# EAGLE design working (EAGLE 9.5.0)
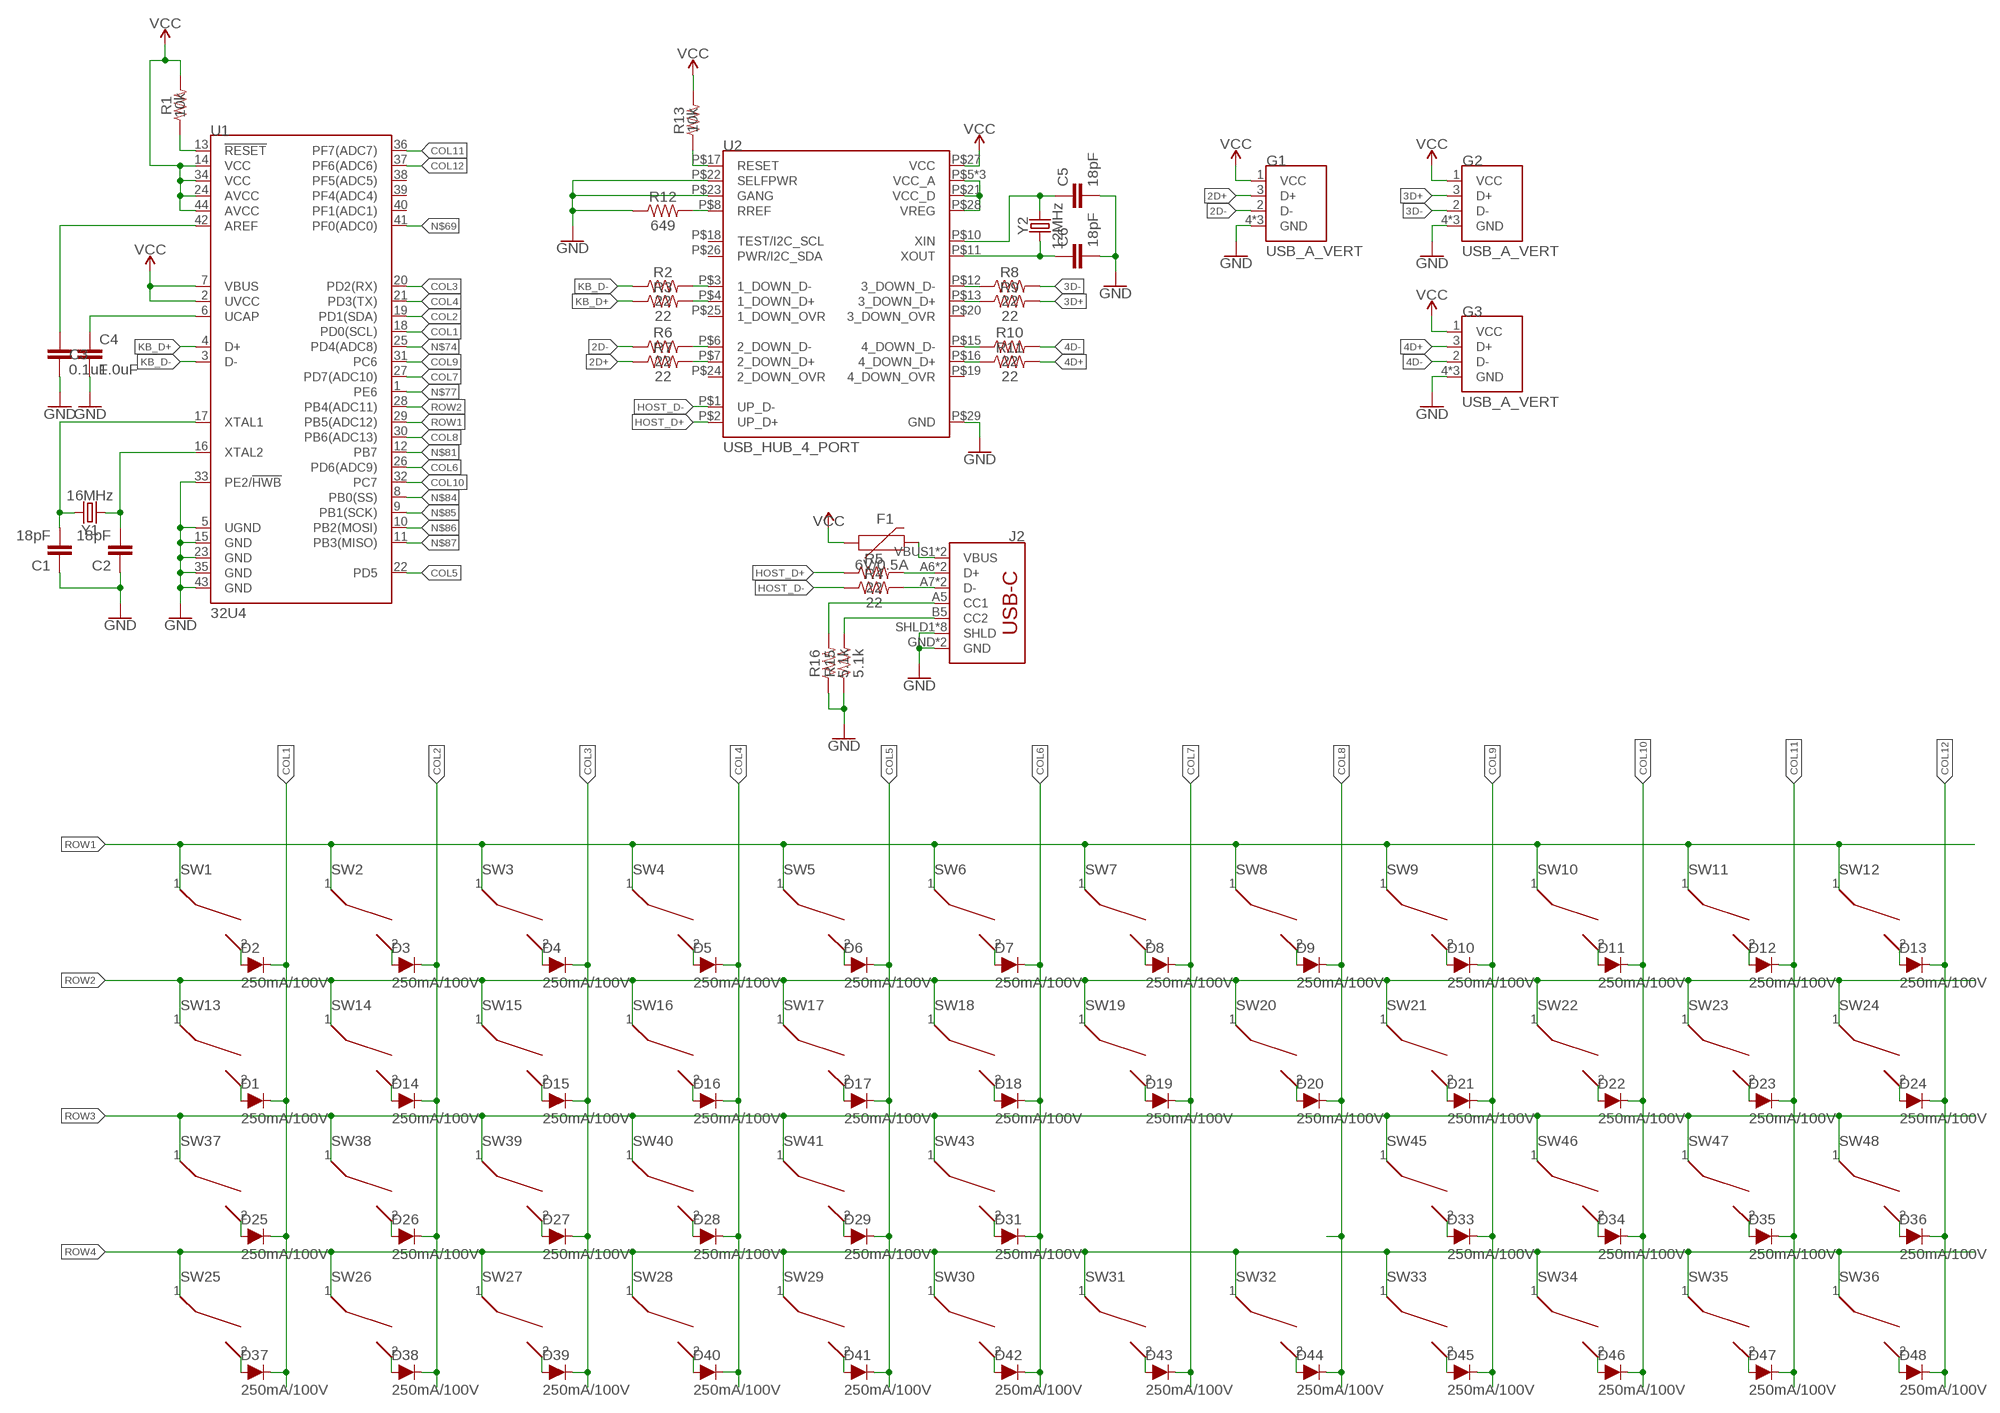
[diagram p0: schematic, sheet 1]

## Parts
C1  18pF  18PF-0603-50V-5%  [0603]
C2  18pF  18PF-0603-50V-5%  [0603]
C3  0.1uF  0.1UF-0603-25V-(+80/-20%)  [0603]
C4  1.0uF  1.0UF-0603-16V-10%  [0603]
C5  18pF  18PF-0603-50V-5%  [0603]
C6  18pF  18PF-0603-50V-5%  [0603]
D1  250mA/100V  DIODE-BAS16J  [SOD-323]
D2  250mA/100V  DIODE-BAS16J  [SOD-323]
D3  250mA/100V  DIODE-BAS16J  [SOD-323]
D4  250mA/100V  DIODE-BAS16J  [SOD-323]
D5  250mA/100V  DIODE-BAS16J  [SOD-323]
D6  250mA/100V  DIODE-BAS16J  [SOD-323]
D7  250mA/100V  DIODE-BAS16J  [SOD-323]
D8  250mA/100V  DIODE-BAS16J  [SOD-323]
D9  250mA/100V  DIODE-BAS16J  [SOD-323]
D10  250mA/100V  DIODE-BAS16J  [SOD-323]
D11  250mA/100V  DIODE-BAS16J  [SOD-323]
D12  250mA/100V  DIODE-BAS16J  [SOD-323]
D13  250mA/100V  DIODE-BAS16J  [SOD-323]
D14  250mA/100V  DIODE-BAS16J  [SOD-323]
D15  250mA/100V  DIODE-BAS16J  [SOD-323]
D16  250mA/100V  DIODE-BAS16J  [SOD-323]
D17  250mA/100V  DIODE-BAS16J  [SOD-323]
D18  250mA/100V  DIODE-BAS16J  [SOD-323]
D19  250mA/100V  DIODE-BAS16J  [SOD-323]
D20  250mA/100V  DIODE-BAS16J  [SOD-323]
D21  250mA/100V  DIODE-BAS16J  [SOD-323]
D22  250mA/100V  DIODE-BAS16J  [SOD-323]
D23  250mA/100V  DIODE-BAS16J  [SOD-323]
D24  250mA/100V  DIODE-BAS16J  [SOD-323]
D25  250mA/100V  DIODE-BAS16J  [SOD-323]
D26  250mA/100V  DIODE-BAS16J  [SOD-323]
D27  250mA/100V  DIODE-BAS16J  [SOD-323]
D28  250mA/100V  DIODE-BAS16J  [SOD-323]
D29  250mA/100V  DIODE-BAS16J  [SOD-323]
D31  250mA/100V  DIODE-BAS16J  [SOD-323]
D33  250mA/100V  DIODE-BAS16J  [SOD-323]
D34  250mA/100V  DIODE-BAS16J  [SOD-323]
D35  250mA/100V  DIODE-BAS16J  [SOD-323]
D36  250mA/100V  DIODE-BAS16J  [SOD-323]
D37  250mA/100V  DIODE-BAS16J  [SOD-323]
D38  250mA/100V  DIODE-BAS16J  [SOD-323]
D39  250mA/100V  DIODE-BAS16J  [SOD-323]
D40  250mA/100V  DIODE-BAS16J  [SOD-323]
D41  250mA/100V  DIODE-BAS16J  [SOD-323]
D42  250mA/100V  DIODE-BAS16J  [SOD-323]
D43  250mA/100V  DIODE-BAS16J  [SOD-323]
D44  250mA/100V  DIODE-BAS16J  [SOD-323]
D45  250mA/100V  DIODE-BAS16J  [SOD-323]
D46  250mA/100V  DIODE-BAS16J  [SOD-323]
D47  250mA/100V  DIODE-BAS16J  [SOD-323]
D48  250mA/100V  DIODE-BAS16J  [SOD-323]
F1  6V/0.5A  PPTC_6V500MA-2  [1206]
G1  USB_A_VERT  [USB_A_VERT]
G2  USB_A_VERT  [USB_A_VERT]
G3  USB_A_VERT  [USB_A_VERT]
J2  USB_C2-LAYER  [USB-C-16P]
R1  10k  10KOHM-0603-1/10W-1%  [0603]
R2  22  22OHM-0603-1/10W-1%  [0603]
R3  22  22OHM-0603-1/10W-1%  [0603]
R4  22  22OHM-0603-1/10W-1%  [0603]
R5  22  22OHM-0603-1/10W-1%  [0603]
R6  22  22OHM-0603-1/10W-1%  [0603]
R7  22  22OHM-0603-1/10W-1%  [0603]
R8  22  22OHM-0603-1/10W-1%  [0603]
R9  22  22OHM-0603-1/10W-1%  [0603]
R10  22  22OHM-0603-1/10W-1%  [0603]
R11  22  22OHM-0603-1/10W-1%  [0603]
R12  649  680OHM-0603-1/10W-5%  [0603]
R13  10k  10KOHM-0603-1/10W-1%  [0603]
R15  5.1k  5.1KOHM5.1KOHM-0603-1/10W-1%  [0603]
R16  5.1k  5.1KOHM5.1KOHM-0603-1/10W-1%  [0603]
SW1  CHERRY_MX_WITH_FIXING_PINS  [MX1A-XXNW]
SW2  CHERRY_MX_WITH_FIXING_PINS  [MX1A-XXNW]
SW3  CHERRY_MX_WITH_FIXING_PINS  [MX1A-XXNW]
SW4  CHERRY_MX_WITH_FIXING_PINS  [MX1A-XXNW]
SW5  CHERRY_MX_WITH_FIXING_PINS  [MX1A-XXNW]
SW6  CHERRY_MX_WITH_FIXING_PINS  [MX1A-XXNW]
SW7  CHERRY_MX_WITH_FIXING_PINS  [MX1A-XXNW]
SW8  CHERRY_MX_WITH_FIXING_PINS  [MX1A-XXNW]
SW9  CHERRY_MX_WITH_FIXING_PINS  [MX1A-XXNW]
SW10  CHERRY_MX_WITH_FIXING_PINS  [MX1A-XXNW]
SW11  CHERRY_MX_WITH_FIXING_PINS  [MX1A-XXNW]
SW12  CHERRY_MX_WITH_FIXING_PINS  [MX1A-XXNW]
SW13  CHERRY_MX_WITH_FIXING_PINS  [MX1A-XXNW]
SW14  CHERRY_MX_WITH_FIXING_PINS  [MX1A-XXNW]
SW15  CHERRY_MX_WITH_FIXING_PINS  [MX1A-XXNW]
SW16  CHERRY_MX_WITH_FIXING_PINS  [MX1A-XXNW]
SW17  CHERRY_MX_WITH_FIXING_PINS  [MX1A-XXNW]
SW18  CHERRY_MX_WITH_FIXING_PINS  [MX1A-XXNW]
SW19  CHERRY_MX_WITH_FIXING_PINS  [MX1A-XXNW]
SW20  CHERRY_MX_WITH_FIXING_PINS  [MX1A-XXNW]
SW21  CHERRY_MX_WITH_FIXING_PINS  [MX1A-XXNW]
SW22  CHERRY_MX_WITH_FIXING_PINS  [MX1A-XXNW]
SW23  CHERRY_MX_WITH_FIXING_PINS  [MX1A-XXNW]
SW24  CHERRY_MX_WITH_FIXING_PINS  [MX1A-XXNW]
SW25  CHERRY_MX_WITH_FIXING_PINS  [MX1A-XXNW]
SW26  CHERRY_MX_WITH_FIXING_PINS  [MX1A-XXNW]
SW27  CHERRY_MX_WITH_FIXING_PINS  [MX1A-XXNW]
SW28  CHERRY_MX_WITH_FIXING_PINS  [MX1A-XXNW]
SW29  CHERRY_MX_WITH_FIXING_PINS  [MX1A-XXNW]
SW30  CHERRY_MX_WITH_FIXING_PINS  [MX1A-XXNW]
SW31  CHERRY_MX_WITH_FIXING_PINS  [MX1A-XXNW]
SW32  CHERRY_MX_WITH_FIXING_PINS  [MX1A-XXNW]
SW33  CHERRY_MX_WITH_FIXING_PINS  [MX1A-XXNW]
SW34  CHERRY_MX_WITH_FIXING_PINS  [MX1A-XXNW]
SW35  CHERRY_MX_WITH_FIXING_PINS  [MX1A-XXNW]
SW36  CHERRY_MX_WITH_FIXING_PINS  [MX1A-XXNW]
SW37  CHERRY_MX_WITH_FIXING_PINS  [MX1A-XXNW]
SW38  CHERRY_MX_WITH_FIXING_PINS  [MX1A-XXNW]
SW39  CHERRY_MX_WITH_FIXING_PINS  [MX1A-XXNW]
SW40  CHERRY_MX_WITH_FIXING_PINS  [MX1A-XXNW]
SW41  CHERRY_MX_WITH_FIXING_PINS  [MX1A-XXNW]
SW43  CHERRY_MX_WITH_FIXING_PINS  [MX1A-XXNW]
SW45  CHERRY_MX_WITH_FIXING_PINS  [MX1A-XXNW]
SW46  CHERRY_MX_WITH_FIXING_PINS  [MX1A-XXNW]
SW47  CHERRY_MX_WITH_FIXING_PINS  [MX1A-XXNW]
SW48  CHERRY_MX_WITH_FIXING_PINS  [MX1A-XXNW]
U1  32U4  ATMEGA32U41:1  [QFN-44-NOPAD_1:1]
U2  USB_HUB_4_PORT  [QFN-28-5MM-1:1]
Y1  16MHz  CRYSTAL-16MHZSMD-5X3.2  [CRYSTAL-SMD-5X3.2-4PAD]
Y2  12MHz  CRYSTAL-12MHZ"  [CRYSTAL-SMD-5X3.2-4PAD]

## Nets
2D+: G1.3(D+) R7.1
2D-: G1.2(D-) R6.1
3D+: G2.3(D+) R9.2
3D-: G2.2(D-) R8.2
4D+: G3.3(D+) R11.2
4D-: G3.2(D-) R10.2
COL1: D1.C D2.C D25.C D37.C U1.18(PD0(SCL))
COL2: D3.C D14.C D26.C D38.C U1.19(PD1(SDA))
COL3: D4.C D15.C D27.C D39.C U1.20(PD2(RX))
COL4: D5.C D16.C D28.C D40.C U1.21(PD3(TX))
COL5: D6.C D17.C D29.C D41.C U1.22(PD5)
COL6: D7.C D18.C D31.C D42.C U1.26(PD6(ADC9))
COL7: D8.C D19.C D43.C U1.27(PD7(ADC10))
COL8: D9.C D20.C D44.C U1.30(PB6(ADC13))
COL9: D10.C D21.C D33.C D45.C U1.31(PC6)
COL10: D11.C D22.C D34.C D46.C U1.32(PC7)
COL11: D12.C D23.C D35.C D47.C U1.36(PF7(ADC7))
COL12: D13.C D24.C D36.C D48.C U1.37(PF6(ADC6))
GND: C1.1 C2.1 C3.2 C4.2 C5.2 C6.2 G1.4(GND) G1.SHIELD_1(GND) G1.SHIELD_2(GND) G2.4(GND) G2.SHIELD_1(GND) G2.SHIELD_2(GND) G3.4(GND) G3.SHIELD_1(GND) G3.SHIELD_2(GND) J2.GND J2.GND2(GND) J2.SHLD1(SHLD) J2.SHLD2(SHLD) J2.SHLD3(SHLD) J2.SHLD4(SHLD) J2.SHLD5(SHLD) J2.SHLD6(SHLD) J2.SHLD7(SHLD) J2.SHLD8(SHLD) R12.1 R15.1 R16.1 U1.5(UGND) U1.15(GND) U1.23(GND) U1.33(PE2/!HWB) U1.35(GND) U1.43(GND) U2.P$22(SELFPWR) U2.P$23(GANG) U2.P$29(GND)
HOST-: J2.A7(D-) J2.B7(D-) R4.2
HOST_D+: R5.1 U2.P$2(UP_D+)
HOST_D-: R4.1 U2.P$1(UP_D-)
KB_D+: R3.1 U1.4(D+)
KB_D-: R2.1 U1.3(D-)
KBD+: R3.2 U2.P$4(1_DOWN_D+)
KBD-: R2.2 U2.P$3(1_DOWN_D-)
N$1: D2.A SW1.2
N$2: D3.A SW2.2
N$3: D4.A SW3.2
N$4: D5.A SW4.2
N$5: D6.A SW5.2
N$6: D7.A SW6.2
N$7: D8.A SW7.2
N$8: D9.A SW8.2
N$9: D10.A SW9.2
N$10: D11.A SW10.2
N$11: D12.A SW11.2
N$12: D13.A SW12.2
N$13: D1.A SW13.2
N$14: D25.A SW37.2
N$15: D37.A SW25.2
N$16: D38.A SW26.2
N$17: D26.A SW38.2
N$18: D14.A SW14.2
N$19: D15.A SW15.2
N$20: D16.A SW16.2
N$21: D28.A SW40.2
N$22: D27.A SW39.2
N$23: D39.A SW27.2
N$24: D40.A SW28.2
N$25: D41.A SW29.2
N$26: D42.A SW30.2
N$27: D29.A SW41.2
N$28: D17.A SW17.2
N$29: D18.A SW18.2
N$30: J2.A6(D+) J2.B6(D+) R5.2
N$31: D43.A SW31.2
N$32: D31.A SW43.2
N$33: D19.A SW19.2
N$34: D23.A SW23.2
N$35: D22.A SW22.2
N$36: D21.A SW21.2
N$37: D20.A SW20.2
N$38: J2.A5(CC1) R16.2
N$39: D33.A SW45.2
N$40: D34.A SW46.2
N$41: D35.A SW47.2
N$42: D36.A SW48.2
N$43: D24.A SW24.2
N$44: D48.A SW36.2
N$45: D47.A SW35.2
N$46: D46.A SW34.2
N$47: D45.A SW33.2
N$48: D44.A SW32.2
N$49: R1.1 U1.13(!RESET)
N$50: C3.1 U1.42(AREF)
N$51: C1.2 U1.17(XTAL1) Y1.3
N$52: C2.2 U1.16(XTAL2) Y1.1
N$53: C4.1 U1.6(UCAP)
N$54: R6.2 U2.P$6(2_DOWN_D-)
N$55: U2.P$5(VCC_A) U2.P$9(VCC_A) U2.P$14(VCC_A) U2.P$21(VCC_D) U2.P$28(VREG)
N$56: R7.2 U2.P$7(2_DOWN_D+)
N$57: R8.1 U2.P$12(3_DOWN_D-)
N$58: R9.1 U2.P$13(3_DOWN_D+)
N$59: R10.1 U2.P$15(4_DOWN_D-)
N$60: R11.1 U2.P$16(4_DOWN_D+)
N$61: C5.1 U2.P$10(XIN) Y2.3
N$62: C6.1 U2.P$11(XOUT) Y2.1
N$64: R13.1 U2.P$17(RESET)
N$65: F1.2 J2.VBUS1(VBUS) J2.VBUS2(VBUS)
N$66: R12.2 U2.P$8(RREF)
N$67: J2.B5(CC2) R15.2
N$69: U1.41(PF0(ADC0))
N$74: U1.25(PD4(ADC8))
N$77: U1.1(PE6)
N$81: U1.12(PB7)
N$84: U1.8(PB0(SS))
N$85: U1.9(PB1(SCK))
N$86: U1.10(PB2(MOSI))
N$87: U1.11(PB3(MISO))
ROW1: SW1.1 SW2.1 SW3.1 SW4.1 SW5.1 SW6.1 SW7.1 SW8.1 SW9.1 SW10.1 SW11.1 SW12.1 U1.29(PB5(ADC12))
ROW2: SW13.1 SW14.1 SW15.1 SW16.1 SW17.1 SW18.1 SW19.1 SW20.1 SW21.1 SW22.1 SW23.1 SW24.1 U1.28(PB4(ADC11))
ROW3: SW37.1 SW38.1 SW39.1 SW40.1 SW41.1 SW43.1 SW45.1 SW46.1 SW47.1 SW48.1
ROW4: SW25.1 SW26.1 SW27.1 SW28.1 SW29.1 SW30.1 SW31.1 SW32.1 SW33.1 SW34.1 SW35.1 SW36.1
VCC: F1.1 G1.1(VCC) G2.1(VCC) G3.1(VCC) R1.2 R13.2 U1.2(UVCC) U1.7(VBUS) U1.14(VCC) U1.24(AVCC) U1.34(VCC) U1.44(AVCC) U2.P$27(VCC)
Unconnected: U1.38(PF5(ADC5)) U1.39(PF4(ADC4)) U1.40(PF1(ADC1)) U2.P$18(TEST/I2C_SCL) U2.P$19(4_DOWN_OVR) U2.P$20(3_DOWN_OVR) U2.P$24(2_DOWN_OVR) U2.P$25(1_DOWN_OVR) U2.P$26(PWR/I2C_SDA)

## Library data of the parts
C1 C2 C5 C6 = SparkFun-Capacitors:18PF: 18pF ceramic capacitors A capacitor is a passive two-terminal electrical component used to store electrical energy temporarily in an electric field.; PROD_ID: CAP-08267
C3 = SparkFun-Capacitors:0.1UF: 0.1µF ceramic capacitors A capacitor is a passive two-terminal electrical component used to store electrical energy temporarily in an electric field.; PROD_ID: CAP-00810
C4 = SparkFun-Capacitors:1.0UF: 1µF ceramic capacitors A capacitor is a passive two-terminal electrical component used to store electrical energy temporarily in an electric field.; PROD_ID: CAP-00868
D1-D29 D31 D33-D48 = SparkFun-DiscreteSemi:DIODE: Diode These are standard reverse protection diodes and small signal diodes. SparkFun Products: SparkFun SparkPunk Sound Kit <https://www.sparkfun.com/products/11177> SparkFun ESP8266 Thing <https://www.sparkfun.com/products/13231>; PROD_ID: DIO-09646
F1 = SparkFun-Fuses:PPTC: Resettable Fuse PPTC Resettable Fuse. Really a sort of resistor with a polymeric positive temperature coefficient whose resistance increases dramatically with an increase in temperature. When heated by the power passing through the resistance rises causing the current to be limited, protecting the circuit. This is achieved by the transition of the polymer from a crystalline to an amorphous state where the conductive carbon separates breaking the conductive pathways found in the cool crystalline structure. When a PPTC cools back down it resumes conducting letting the circuit turn back on. SparkFun Products: SparkFun RedBoard - Programmed with Arduino <https://www.sparkfun.com/products/12757> Pro Micro - 5V/16MHz <https://www.sparkfun.com/products/12640> Arduino Pro 328 - 5V/16MHz <https://www.sparkfun.com/products/10915> MP3 Trigger <https://www.sparkfun.com/products/13720>; PROD_ID: RES-08585
G1-G3 = asst:USB_A_VERT
J2 = SparkFun-Connectors:USB_C: USB Type C 16Pin Connector Super Speed pins not available on the 16-pin purely SMD connector so this part is best for USB 2.0 implementations. D1 and D2 are tied together enabling D+/- no matter which way the cable is plugged into the connector. The two channel configuration pins (CC1/2) are exposed. These are normally connected to ground via 5.1k resistors but can be reconfigured for high current/high power applications.; PROD_ID: CONN-14122
R1 R13 = SparkFun-Resistors:10KOHM: 10kΩ resistor A resistor is a passive two-terminal electrical component that implements electrical resistance as a circuit element. Resistors act to reduce current flow, and, at the same time, act to lower voltage levels within circuits. - Wikipedia; PROD_ID: RES-00824
R2-R11 = SparkFun-Resistors:22OHM: 22Ω resistor A resistor is a passive two-terminal electrical component that implements electrical resistance as a circuit element. Resistors act to reduce current flow, and, at the same time, act to lower voltage levels within circuits. - Wikipedia; PROD_ID: RES-08698
R12 = SparkFun-Resistors:680OHM: 680Ω resistor A resistor is a passive two-terminal electrical component that implements electrical resistance as a circuit element. Resistors act to reduce current flow, and, at the same time, act to lower voltage levels within circuits. - Wikipedia; PROD_ID: RES-09333; VALUE: 680
R15 R16 = SparkFun-Resistors:5.1KOHM; PROD_ID: RES-12083
SW1-SW41 SW43 SW45-SW48 = Cherry_MX_v7.0:CHERRY_MX
U1 = SparkFun-IC-Microcontroller:ATMEGA32U4: Atmel MCU, 32KByte Atmel 44-pin 8-bit Microcontroller with 32KBytes of ISP Flash and USB Controller Datasheet <http://cdn.sparkfun.com/datasheets/Dev/Arduino/Boards/ATMega32U4.pdf> SparkFun Products LilyPad Arduino USB - ATmega32U4 Board <https://www.sparkfun.com/products/12049> (DEV-12049) Pro Micro - 5V/16MHz <https://www.sparkfun.com/products/12640> (DEV-12640) Pro Micro - 3.3V/8MHz <https://www.sparkfun.com/products/12587> (DEV-12587) Fio v3 - ATmega32U4 <https://www.sparkfun.com/products/11520> (DEV-11520) Qduino Mini <https://www.sparkfun.com/products/13614> (DEV-13614) Makey Makey - Standard Kit <https://www.sparkfun.com/products/11511> (WIG-11511) Makey Makey Deluxe Kit <https://www.sparkfun.com/products/11519> (WIG-11519); PROD_ID: IC-10828
U2 = asst:USB_HUB_4_PORT
Y1 = SparkFun-Clocks:CRYSTAL-16MHZ: 16MHz Crystal Digikey Example <http://www.digikey.com/product-search/en?keywords=535-9122-1-ND> Frequency: 16MHz Frequency Stability: ±50ppm Frequency Tolerance: ±20ppm Load Capacitance: 18pF SparkFun Products: Pro Micro -5V/16MHz <https://www.sparkfun.com/products/12640> SparkFun Serial Enabled LCD Kit <https://www.sparkfun.com/products/10097>; PROD_ID: XTAL-08218; SF_ID: COM-00094
Y2 = SparkFun-Clocks:CRYSTAL-12MHZ: 12.0MHz Crystal Frequency: 12.0MHz Frequency Tolerance: ±20ppm Load Capacitance: 18pF SparkFun Products: SparkFun Logomatic <https://www.sparkfun.com/products/12772> Pocket AVR Programmer <https://www.sparkfun.com/products/9825>; PROD_ID: XTAL-08297

## Board
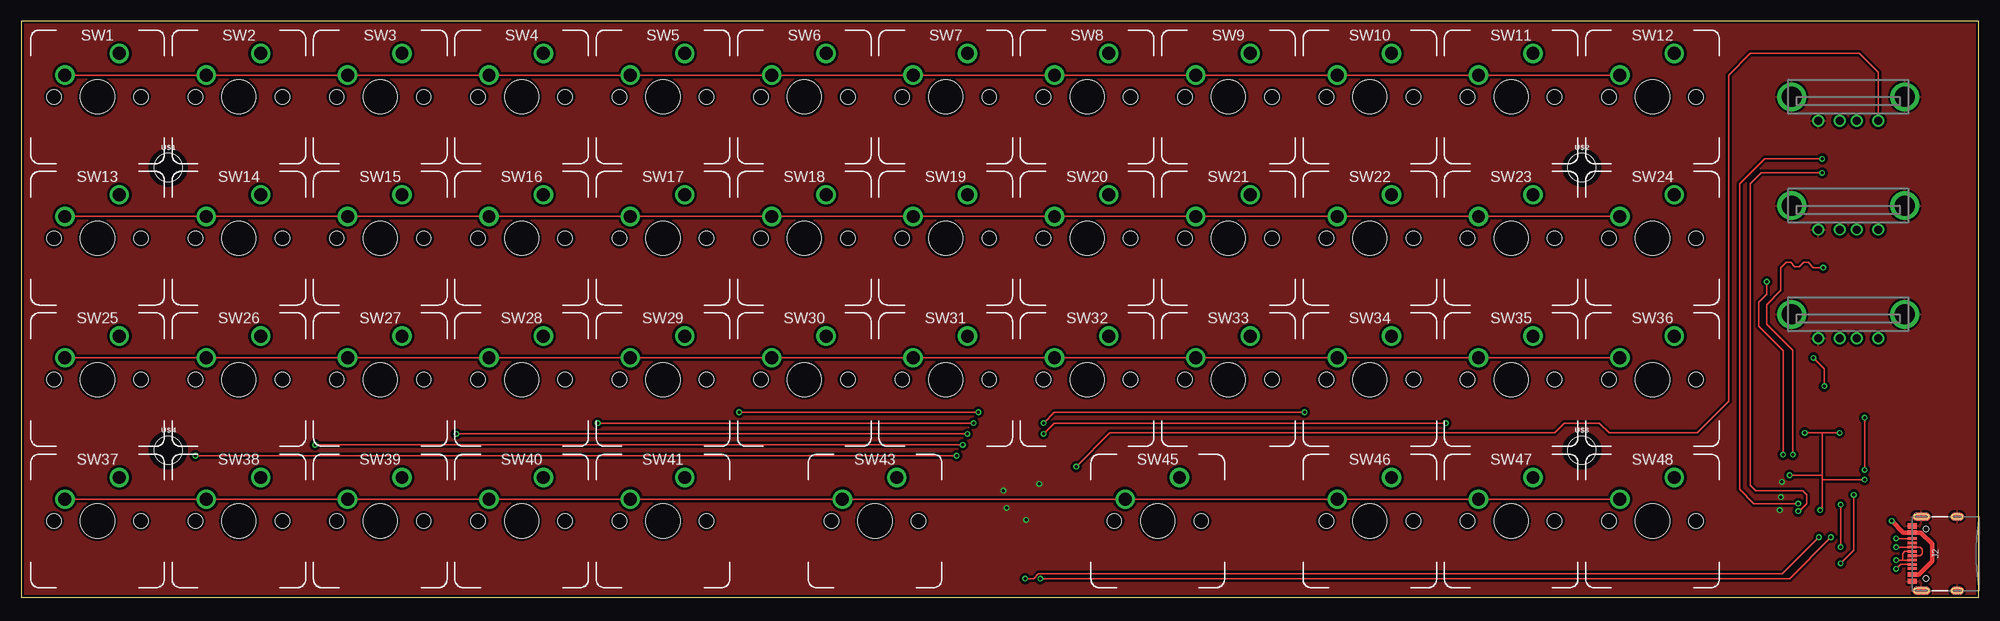
[diagram p1: board, top side]
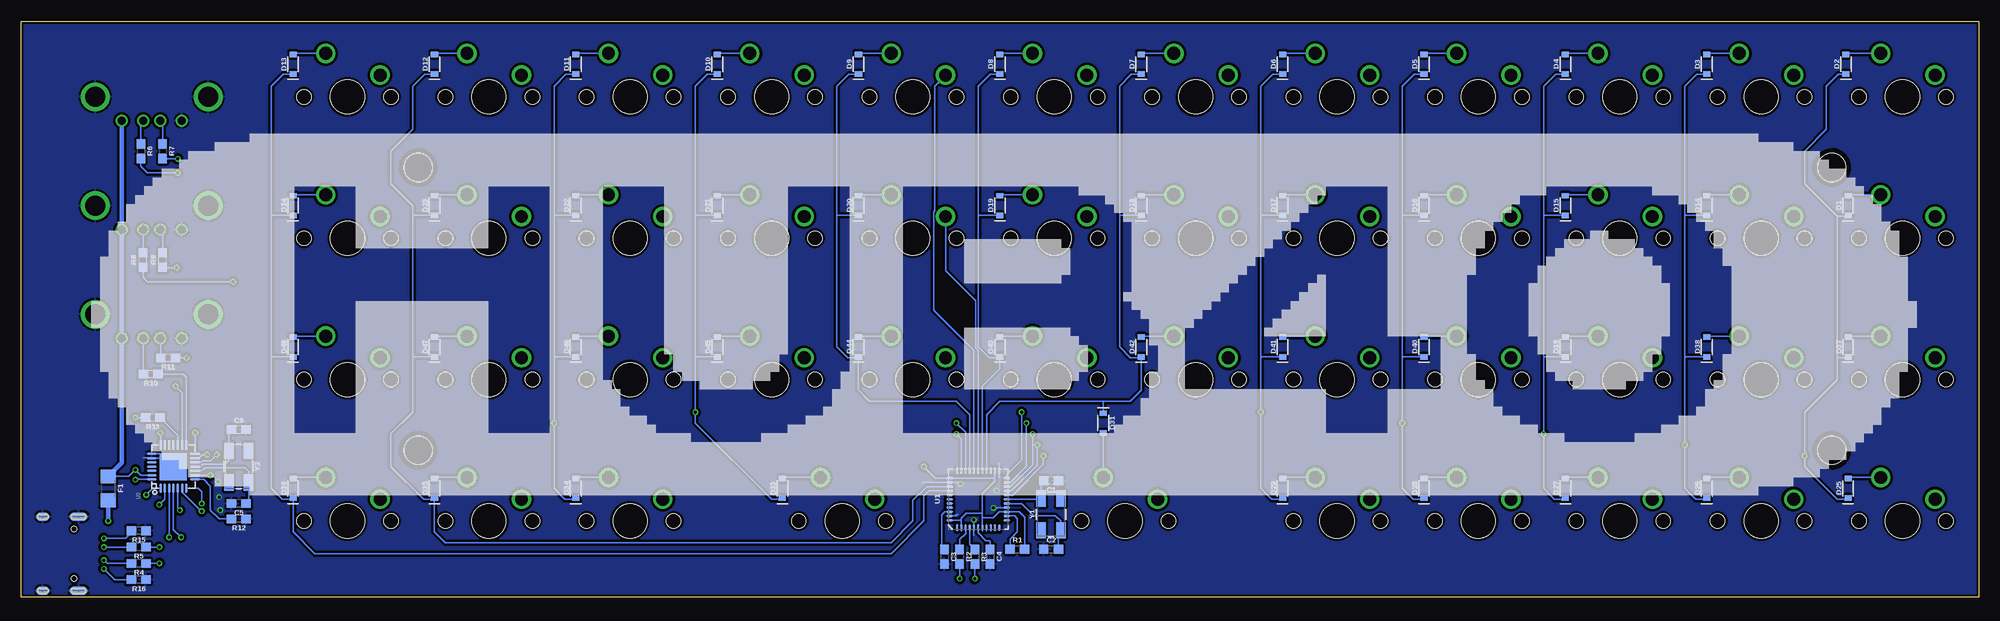
[diagram p2: board, bottom side, seen from below]

Size 228.58 x 67.23 mm. Coordinates in mm from the lower left corner, seen from the top.
Outline: 0,0 228.58,0 228.58,67.23 0,67.23 0,0
Copper layers (1*16): Top 0.035mm / dielectric 1.5mm / Bottom 0.035mm
Design rules "SparkFun-2-layer-PCBWay-LIMIT": minimum track width 6mil, minimum drill 0.3mm, track to track 6mil, track to pad 6mil, pad to pad 6mil, via to via 6mil, smd to smd 6mil, copper to edge 6mil, drill to drill 6mil, minimum pad ring 6mil, minimum via ring 6mil, stop-mask expansion 4mil, vias tented up to drill 25mil, thermal gap 10mil

### Footprints (pad centres in the part's own frame; a part is rotated, then mirrored left to right if it is on the bottom)
0603 = smd 1.1 x 1: 1 -0.85,0; 2 0.85,0
SOD-323 = smd 0.63 x 0.83: A 1.15,0; C -1.15,0
1206 = smd 1.6 x 1.8: 1 -1.4,0; 2 1.4,0
USB_A_VERT = drill 0.92: 1 -3.5,2.8; 2 -1,2.8; 3 1,2.8; 4 3.5,2.8 | drill 2.33: SHIELD_1 -6.6,0; SHIELD_2 6.6,0
USB-C-16P = smd 0.3 x 1.016: A5 -1.25,0.154; A6 -0.25,0.154; A7 0.25,0.154; A8 1.25,0.154; B5 1.75,0.154; B6 0.75,0.154; B7 -0.75,0.154; B8 -1.75,0.154 | smd 0.6 x 1.016: GND -3.225,0.154; GND2 3.225,0.154 | smd 1 x 2.1: SHLD1 -4.32,-0.915; SHLD2 4.32,-0.915 | smd 1 x 2.1 bottom: SHLD3 -4.32,-0.915; SHLD4 4.32,-0.915 | smd 1 x 1.6: SHLD5 -4.32,-5.095; SHLD8 4.32,-5.095 | smd 1 x 1.6 bottom: SHLD6 -4.32,-5.095; SHLD7 4.32,-5.095 | smd 0.55 x 1.016: VBUS1 -2.45,0.154; VBUS2 2.45,0.154 | hole 0.65: -2.89,-1.445; 2.89,-1.445
MX1A-XXNW = drill 1.5: 1 -3.81,2.54; 2 2.54,5.08 | hole 4: 0,0 | hole 1.7: -5.08,0; 5.08,0
QFN-44-NOPAD_1:1 = smd 0.8 x 0.3: 1 -3.337,2.458; 2 -3.337,1.958; 3 -3.337,1.479; 4 -3.337,0.979; 5 -3.337,0.5; 6 -3.337,0; 7 -3.337,-0.5; 8 -3.337,-0.979; 9 -3.337,-1.479; 10 -3.337,-1.958; 11 -3.337,-2.458; 23 3.337,-2.458; 24 3.337,-1.958; 25 3.337,-1.479; 26 3.337,-0.979; 27 3.337,-0.5; 28 3.337,0; 29 3.337,0.5; 30 3.337,0.979; 31 3.337,1.479; 32 3.337,1.958; 33 3.337,2.458 | smd 0.3 x 0.8: 12 -2.458,-3.337; 13 -1.958,-3.337; 14 -1.479,-3.337; 15 -0.979,-3.337; 16 -0.5,-3.337; 17 0,-3.337; 18 0.5,-3.337; 19 0.979,-3.337; 20 1.479,-3.337; 21 1.958,-3.337; 22 2.458,-3.337; 34 2.458,3.337; 35 1.958,3.337; 36 1.479,3.337; 37 0.979,3.337; 38 0.5,3.337; 39 0,3.337; 40 -0.5,3.337; 41 -0.979,3.337; 42 -1.479,3.337; 43 -1.958,3.337; 44 -2.458,3.337
QFN-28-5MM-1:1 = smd 1.15 x 0.3: P$1 -2.527,1.5; P$2 -2.527,1; P$3 -2.527,0.5; P$4 -2.527,0; P$5 -2.527,-0.5; P$6 -2.527,-1; P$7 -2.527,-1.5; P$15 2.527,-1.5; P$16 2.527,-1; P$17 2.527,-0.5; P$18 2.527,0; P$19 2.527,0.5; P$20 2.527,1; P$21 2.527,1.5 | smd 0.3 x 1.15: P$8 -1.5,-2.527; P$9 -1,-2.527; P$10 -0.5,-2.527; P$11 0,-2.527; P$12 0.5,-2.527; P$13 1,-2.527; P$14 1.5,-2.527; P$22 1.5,2.527; P$23 1,2.527; P$24 0.5,2.527; P$25 0,2.527; P$26 -0.5,2.527; P$27 -1,2.527; P$28 -1.5,2.527 | smd 3.15 x 3.15: P$29 0,0
STAND-OFF = hole 3.302: 0,0
CRYSTAL-SMD-5X3.2-4PAD = smd 1.9 x 1.1: 1 -1.85,-1.15; 2 1.85,-1.15; 3 1.85,1.15; 4 -1.85,1.15

### Placement (x,y rotation side)
C1  108.33,13.59 180 bottom
C2  108.33,5.59 0 bottom
C3  120.78,4.7 270 bottom
C4  115.44,4.7 270 bottom
C5  203.2,10.92 180 bottom
C6  203.2,19.56 0 bottom
D1  15.24,45.72 90 bottom
D2  15.49,62.23 90 bottom
D3  31.75,62.23 90 bottom
D4  48.26,62.23 90 bottom
D5  64.77,62.23 90 bottom
D6  81.28,62.23 90 bottom
D7  97.79,62.23 90 bottom
D8  114.3,62.23 90 bottom
D9  130.81,62.23 90 bottom
D10  147.32,62.23 90 bottom
D11  163.83,62.23 90 bottom
D12  180.34,62.23 90 bottom
D13  196.85,62.23 90 bottom
D14  31.75,45.72 90 bottom
D15  48.26,45.72 90 bottom
D16  64.77,45.72 90 bottom
D17  81.28,45.72 90 bottom
D18  97.79,45.72 90 bottom
D19  114.3,45.72 90 bottom
D20  130.81,45.72 90 bottom
D21  147.32,45.72 90 bottom
D22  163.83,45.72 90 bottom
D23  180.34,45.72 90 bottom
D24  196.85,45.72 90 bottom
D25  15.24,12.7 90 bottom
D26  31.75,12.7 90 bottom
D27  48.26,12.7 90 bottom
D28  64.77,12.7 90 bottom
D29  81.28,12.7 90 bottom
D31  102.23,20.32 270 bottom
D33  139.7,12.7 90 bottom
D34  163.83,12.7 90 bottom
D35  180.34,12.7 90 bottom
D36  196.85,12.7 90 bottom
D37  15.24,29.21 90 bottom
D38  31.75,29.21 90 bottom
D39  48.26,29.21 90 bottom
D40  64.77,29.21 90 bottom
D41  81.28,29.21 90 bottom
D42  97.79,29.21 90 bottom
D43  114.3,29.21 90 bottom
D44  130.81,29.21 90 bottom
D45  147.32,29.21 90 bottom
D46  163.83,29.21 90 bottom
D47  180.34,29.21 90 bottom
D48  196.85,29.21 90 bottom
F1  218.44,12.7 270 bottom
G1  213.36,58.42 180 top
G2  213.36,45.72 180 top
G3  213.36,33.02 180 top
J2  220.98,5.08 90 top
R1  112.27,5.59 0 bottom
R2  119,4.7 270 bottom
R3  117.22,4.7 270 bottom
R4  214.88,3.94 180 bottom
R5  214.88,5.84 180 bottom
R6  214.63,52.07 270 bottom
R7  212.09,52.07 270 bottom
R8  214.38,39.37 90 bottom
R9  212.09,39.37 90 bottom
R10  213.49,26.04 180 bottom
R11  211.46,27.94 180 bottom
R12  203.2,9.14 180 bottom
R13  213.23,20.95 180 bottom
R15  214.88,7.75 180 bottom
R16  214.88,2.03 180 bottom
SW1  8.89,58.42 0 top
SW2  25.4,58.42 0 top
SW3  41.91,58.42 0 top
SW4  58.42,58.42 0 top
SW5  74.93,58.42 0 top
SW6  91.44,58.42 0 top
SW7  107.95,58.42 0 top
SW8  124.46,58.42 0 top
SW9  140.97,58.42 0 top
SW10  157.48,58.42 0 top
SW11  173.99,58.42 0 top
SW12  190.5,58.42 0 top
SW13  8.89,41.91 0 top
SW14  25.4,41.91 0 top
SW15  41.91,41.91 0 top
SW16  58.42,41.91 0 top
SW17  74.93,41.91 0 top
SW18  91.44,41.91 0 top
SW19  107.95,41.91 0 top
SW20  124.46,41.91 0 top
SW21  140.97,41.91 0 top
SW22  157.48,41.91 0 top
SW23  173.99,41.91 0 top
SW24  190.5,41.91 0 top
SW25  8.89,25.4 0 top
SW26  25.4,25.4 0 top
SW27  41.91,25.4 0 top
SW28  58.42,25.4 0 top
SW29  74.93,25.4 0 top
SW30  91.44,25.4 0 top
SW31  107.95,25.4 0 top
SW32  124.46,25.4 0 top
SW33  140.97,25.4 0 top
SW34  157.48,25.4 0 top
SW35  173.99,25.4 0 top
SW36  190.5,25.4 0 top
SW37  8.89,8.89 0 top
SW38  25.4,8.89 0 top
SW39  41.91,8.89 0 top
SW40  58.42,8.89 0 top
SW41  74.93,8.89 0 top
SW43  99.69,8.89 0 top
SW45  132.72,8.89 0 top
SW46  157.48,8.89 0 top
SW47  173.99,8.89 0 top
SW48  190.5,8.89 0 top
U1  116.84,11.43 90 bottom
U2  210.82,15.24 90 bottom
U$1  [STAND-OFF]  17.14,50.16 0 top
U$2  [STAND-OFF]  182.25,50.16 0 top
U$3  [STAND-OFF]  182.25,17.14 0 top
U$4  [STAND-OFF]  17.14,17.14 0 top
U$5  [HUB400]  223.52,33.02 0 bottom
Y1  108.33,9.65 90 bottom
Y2  203.2,15.24 270 bottom

### Tracks (layer width: path | path; a pad name or v marks a point on that pad's centre or on a via)
2D+
  Bottom 0.152: R7.1 212.09,55.35 G1.3
2D-
  Bottom 0.152: R6.1 214.63,55.35 G1.2
3D+
  Bottom 0.152: R9.2 212.09,42.65 G2.3
3D-
  Bottom 0.152: R8.2 214.38,42.9 G2.2
4D+
  Bottom 0.152: R11.2 212.31,30.16 G3.3
4D-
  Bottom 0.152: R10.2 214.34,30.2 G3.2
COL1  (via drill 0.35)
  Top 0.152: v109.22,16.51 v20.32,16.51
  Bottom 0.152: D25.C 15.36,11.43 16.51,11.43 20.32,15.24 v20.32,16.51 20.32,21.59 16.51,25.4 16.51,27.94 | U1.18 113.48,11.9 112.83,11.9 109.22,15.51 v109.22,16.51 | D2.C 16.39,61.08 17.78,59.69 17.78,54.61 20.32,52.07 20.32,48.26 16.51,44.45 | 16.51,44.45 15.36,44.45 D1.C | D37.C 15.36,27.94 16.51,27.94 | 16.51,27.94 16.51,44.45
COL2  (via drill 0.35)
  Top 0.152: v109.93,17.78 v34.29,17.78
  Bottom 0.152: D3.C 32.9,61.08 34.29,59.69 34.29,44.45 | 34.29,44.45 34.29,27.94 | 34.29,27.94 v34.29,17.78 34.29,12.7 33.02,11.43 31.87,11.43 D26.C | D38.C 34.17,28.06 34.29,27.94 | D14.C 34.17,44.57 34.29,44.45 | U1.19 112.96,12.4 109.93,15.43 v109.93,17.78
COL3  (via drill 0.35)
  Top 0.152: v110.49,19.05 v50.8,19.05
  Bottom 0.152: D4.C 49.41,61.08 50.8,59.69 50.8,44.45 | 50.8,44.45 50.8,27.94 | 50.8,27.94 v50.8,19.05 50.8,12.7 49.53,11.43 48.38,11.43 D27.C | D39.C 50.68,28.06 50.8,27.94 | D15.C 50.68,44.57 50.8,44.45 | U1.20 113.48,12.88 113.08,12.88 110.49,15.48 v110.49,19.05
COL4  (via drill 0.35)
  Top 0.152: v111.2,20.32 v67.31,20.32
  Bottom 0.152: D5.C 65.92,61.08 67.31,59.69 67.31,44.45 | 67.31,44.45 67.31,27.94 | 67.31,27.94 v67.31,20.32 67.31,12.7 66.04,11.43 64.89,11.43 D28.C | D40.C 67.19,28.06 67.31,27.94 | D16.C 67.19,44.57 67.31,44.45 | U1.21 113.08,13.38 111.2,15.26 v111.2,20.32
COL5  (via drill 0.35)
  Top 0.152: v111.76,21.59 v83.82,21.59
  Bottom 0.152: D6.C 82.43,61.08 83.82,59.69 83.82,44.45 | 83.82,44.45 83.82,27.94 | 83.82,27.94 v83.82,21.59 83.82,12.7 82.55,11.43 81.4,11.43 D29.C | D41.C 83.7,28.06 83.82,27.94 | D17.C 83.7,44.57 83.82,44.45 | U1.22 113.5,14.27 111.76,16.01 v111.76,21.59
COL6
  Bottom 0.152: D7.C 98.94,61.08 100.33,59.69 100.33,44.45 | 100.33,44.45 100.33,29.21 99.06,27.94 97.91,27.94 97.85,28 | 97.85,28 D42.C | D18.C 100.21,44.57 100.33,44.45 | U1.26 115.86,21.3 114.3,22.86 102.23,22.86 | 102.23,22.86 99.06,22.86 97.79,24.13 97.79,27.94 97.85,28 | D31.C 102.23,22.86
COL7
  Bottom 0.152: D8.C 115.45,61.08 116.84,59.69 116.84,44.45 | 116.84,44.45 116.84,29.21 115.57,27.94 114.42,27.94 | 114.42,27.94 D43.C | D19.C 116.72,44.57 116.84,44.45 | U1.27 116.34,24.63 114.3,26.67 114.3,27.82 114.42,27.94
COL8
  Bottom 0.152: D9.C 131.96,61.08 133.35,59.69 133.35,44.45 | 133.35,44.45 133.35,29.21 132.08,27.94 130.93,27.94 130.87,28 | 130.87,28 D44.C | D20.C 133.23,44.57 133.35,44.45 | U1.30 117.82,21.3 119.38,22.86 129.54,22.86 130.87,24.19 130.87,28
COL9  (via drill 0.35)
  Top 0.152: v119.38,20.32 120.65,21.59 v149.86,21.59
  Bottom 0.152: D10.C 148.47,61.08 149.86,59.69 149.86,44.45 | 149.86,44.45 149.86,27.94 | 149.86,27.94 v149.86,21.59 149.86,20.32 140.97,11.43 139.82,11.43 D33.C | D45.C 149.74,28.06 149.86,27.94 | D21.C 149.74,44.57 149.86,44.45 | U1.31 118.32,19.26 v119.38,20.32
COL10  (via drill 0.35)
  Top 0.152: v119.38,19.05 120.65,20.32 v166.37,20.32
  Bottom 0.152: D11.C 164.98,61.08 166.37,59.69 166.37,44.45 | 166.37,44.45 166.37,27.94 | 166.37,27.94 v166.37,20.32 166.37,12.7 165.1,11.43 163.95,11.43 D34.C | D46.C 166.25,28.06 166.37,27.94 | D22.C 166.25,44.57 166.37,44.45 | U1.32 118.8,18.47 v119.38,19.05
COL11
  Bottom 0.152: D12.C 181.49,61.08 182.88,59.69 182.88,54.61 185.42,52.07 185.42,48.26 182.88,45.72 182.88,44.45 | 182.88,44.45 182.88,27.94 | 182.88,27.94 182.88,21.59 185.42,19.05 185.42,15.24 181.61,11.43 180.46,11.43 D35.C 180.34,7.62 179.07,6.35 127,6.35 124.46,8.89 124.46,11.3 122.85,12.91 U1.36 | D47.C 182.76,28.06 182.88,27.94 | D23.C 182.76,44.57 182.88,44.45
COL12
  Bottom 0.152: D13.C 198,61.08 199.39,59.69 199.39,44.45 | 199.39,44.45 199.39,27.94 | 199.39,27.94 199.39,12.7 198.12,11.43 196.97,11.43 D36.C 196.85,7.62 194.31,5.08 127,5.08 123.19,8.89 123.19,11.81 122.59,12.41 U1.37 | D48.C 199.27,28.06 199.39,27.94 | D24.C 199.27,44.57 199.39,44.45
GND  (via drill 0.35)
  Bottom 0.152: U1.15 115.03,10.45 v115.06,10.41 | 117.35,7.24 U1.5 117.34,8.88 117.35,8.89 | U1.43 119.43,9.47 119.25,9.65 | 214.38,16.26 213.36,16.26 U2.P$23 212.11,16.24 | 212.11,16.24 212.09,16.26 | U2.P$22 212.24,16.74 212.22,16.76 | U2.P$29 211.82,16.24 212.11,16.24 | v118.87,13.21 119.05,13.39 U1.35 123.26,13.39 123.32,13.34 | 114.3,13.97 114.38,14.05 U1.23 114.38,15.58 114.43,15.62
  other vias: 114.68,12.45 117.35,9.02 205.49,11.68 205.61,13.46 205.36,10.16
  pour Top (isolate 0.305): 0,0 0,67.31 228.6,67.31 228.6,0
  pour Bottom (isolate 0.305): 0,0 228.6,0 228.6,67.31 0,67.31
HOST-  (via drill 0.35)
  Top 0.152: J2.B7 220.81,4.32 219.71,4.32 | 219.71,4.32 v218.95,4.32 | J2.A7 219.96,5.33 219.71,5.08 219.71,4.32
  Bottom 0.152: v218.95,4.32 218.57,3.94 R4.2
HOST_D+  (via drill 0.35)
  Top 0.152: v212.47,10.79 v212.47,5.84
  Bottom 0.152: U2.P$2 211.82,11.45 v212.47,10.79 | v212.47,5.84 R5.1
HOST_D-  (via drill 0.35)
  Top 0.152: v212.47,3.94 214,5.46 v214,11.94
  Bottom 0.152: U2.P$1 213.22,12.71 v214,11.94 | R4.1 v212.47,3.94
KB_D+
  Bottom 0.152: U1.4 117.82,6.15 R3.1
KB_D-
  Bottom 0.152: U1.3 118.32,7.41 119,6.73 R2.1
KBD+  (via drill 0.35)
  Top 0.152: v117.22,2.16 118.21,2.16 118.77,2.71 205.66,2.71 v209.93,6.99
  Bottom 0.152: R3.2 v117.22,2.16 | v209.93,6.99 210.82,7.87 U2.P$4
KBD-  (via drill 0.35)
  Top 0.152: v119,2.16 206.5,2.16 v211.33,6.99
  Bottom 0.152: R2.2 v119,2.16 | v211.33,6.99 v211.32,6.99 U2.P$3
N$1
  Bottom 0.152: SW1.2 15.37,63.5 D2.A
N$2
  Bottom 0.152: SW2.2 31.63,63.5 D3.A
N$3
  Bottom 0.152: SW3.2 48.14,63.5 D4.A
N$4
  Bottom 0.152: SW4.2 64.65,63.5 D5.A
N$5
  Bottom 0.152: SW5.2 81.16,63.5 D6.A
N$6
  Bottom 0.152: SW6.2 97.67,63.5 D7.A
N$7
  Bottom 0.152: SW7.2 114.18,63.5 D8.A
N$8
  Bottom 0.152: SW8.2 130.69,63.5 D9.A
N$9
  Bottom 0.152: SW9.2 147.2,63.5 D10.A
N$10
  Bottom 0.152: SW10.2 163.71,63.5 D11.A
N$11
  Bottom 0.152: SW11.2 180.22,63.5 D12.A
N$12
  Bottom 0.152: SW12.2 196.73,63.5 D13.A
N$13
  Bottom 0.152: SW13.2 15.12,46.99 D1.A
N$14
  Bottom 0.152: SW37.2 15.12,13.97 D25.A
N$15
  Bottom 0.152: SW25.2 15.12,30.48 D37.A
N$16
  Bottom 0.152: SW26.2 31.63,30.48 D38.A
N$17
  Bottom 0.152: SW38.2 31.63,13.97 D26.A
N$18
  Bottom 0.152: SW14.2 31.63,46.99 D14.A
N$19
  Bottom 0.152: SW15.2 48.14,46.99 D15.A
N$20
  Bottom 0.152: SW16.2 64.65,46.99 D16.A
N$21
  Bottom 0.152: SW40.2 64.65,13.97 D28.A
N$22
  Bottom 0.152: SW39.2 48.14,13.97 D27.A
N$23
  Bottom 0.152: SW27.2 48.14,30.48 D39.A
N$24
  Bottom 0.152: SW28.2 64.65,30.48 D40.A
N$25
  Bottom 0.152: SW29.2 81.16,30.48 D41.A
N$26
  Bottom 0.152: SW30.2 97.67,30.48 D42.A
N$27
  Bottom 0.152: SW41.2 81.16,13.97 D29.A
N$28
  Bottom 0.152: SW17.2 81.16,46.99 D17.A
N$29
  Bottom 0.152: SW18.2 97.67,46.99 D18.A
N$30  (via drill 0.35)
  Top 0.152: v218.95,5.84 v218.96,5.83 J2.B6 221.75,5.83 222,5.59 222,5.08 221.74,4.83 J2.A6
  Bottom 0.152: v218.95,5.84 R5.2
N$31
  Bottom 0.152: SW31.2 114.18,30.48 D43.A
N$32
  Bottom 0.152: SW43.2 D31.A
N$33
  Bottom 0.152: SW19.2 114.18,46.99 D19.A
N$34
  Bottom 0.152: SW23.2 180.22,46.99 D23.A
N$35
  Bottom 0.152: SW22.2 163.71,46.99 D22.A
N$36
  Bottom 0.152: SW21.2 147.2,46.99 D21.A
N$37
  Bottom 0.152: SW20.2 130.69,46.99 D20.A
N$38  (via drill 0.35)
  Top 0.152: J2.A5 219.48,3.83 v218.95,3.3
  Bottom 0.152: v218.95,3.3 217.68,2.03 R16.2
N$39
  Bottom 0.152: SW45.2 139.58,13.97 D33.A
N$40
  Bottom 0.152: SW46.2 163.71,13.97 D34.A
N$41
  Bottom 0.152: SW47.2 180.22,13.97 D35.A
N$42
  Bottom 0.152: SW48.2 196.73,13.97 D36.A
N$43
  Bottom 0.152: SW24.2 196.73,46.99 D24.A
N$44
  Bottom 0.152: SW36.2 196.73,30.48 D48.A
N$45
  Bottom 0.152: SW35.2 180.22,30.48 D47.A
N$46
  Bottom 0.152: SW34.2 163.71,30.48 D46.A
N$47
  Bottom 0.152: SW33.2 147.2,30.48 D45.A
N$48
  Bottom 0.152: SW32.2 130.69,30.48 D44.A
N$49
  Bottom 0.152: U1.13 112.6,9.47 112.27,9.14 112.27,7.62 113.12,6.77 R1.1
N$50
  Bottom 0.152: U1.42 120.73,9.95 121.08,9.6 121.08,5.85 C3.1
N$51
  Bottom 0.152: U1.17 109.55,11.43 Y1.3 109.48,13.29 C1.2
N$52
  Bottom 0.152: C2.2 107.48,7.5 107.21,7.77 | 107.21,7.77 Y1.1 | U1.16 111.77,10.93 110.36,9.53 107.82,9.53 107.21,8.91 107.21,7.77
N$53
  Bottom 0.152: U1.6 116.84,7.49 115.95,6.6 115.57,6.6 115.44,6.48 C4.1
N$54  (via drill 0.35)
  Top 0.152: v210.31,49.53 203.2,49.53 201.93,48.26 201.93,13.08 202.56,12.45 208.03,12.45 208.53,11.94 208.53,10.92 207.65,10.03 v207.52,10.03
  Bottom 0.152: v207.52,10.03 207.6,10.03 209.82,12.25 U2.P$6 | R6.2 214.63,50.29 213.87,49.53 v210.31,49.53
N$55  (via drill 0.35)
  Top 0.152: v208.28,19.18 210.31,19.18 | v206.5,14.22 210.31,14.22 | 210.31,14.22 210.31,13.72 | 210.31,13.72 210.31,10.41 v210.06,10.16 | 210.31,14.22 210.31,19.18 | v215.26,13.72 210.31,13.72 | v212.34,19.18 210.31,19.18
  Bottom 0.152: U2.P$9 208.28,14.22 v206.5,14.22 | U2.P$21 212.32,19.15 v212.34,19.18 | U2.P$28 215.24,13.74 v215.26,13.72 | U2.P$5 210.32,10.42 v210.06,10.16 | v208.28,19.18 208.29,19.16 U2.P$14
N$56  (via drill 0.35)
  Top 0.152: v210.31,51.18 203.58,51.18 200.66,48.26 200.66,12.57 202.31,10.92 v207.52,10.92
  Bottom 0.152: U2.P$7 209.31,12.7 207.9,12.7 207.52,12.32 v207.52,10.92 | R7.2 210.35,51.22 v210.31,51.18
N$57  (via drill 0.35)
  Top 0.152: v205.74,16.64 205.74,28.78 202.9,31.62 202.9,34.42 203.84,35.36 v203.84,36.83
  Bottom 0.152: U2.P$12 207.58,15.74 207.39,15.93 206.45,15.93 v205.74,16.64 | R8.1 214.38,37.34 213.87,36.83 v203.84,36.83
N$58  (via drill 0.35)
  Top 0.152: v206.88,16.64 206.88,28.83 203.84,31.88 203.84,34.16 205.49,35.81 205.49,38.48 206.12,39.12 206.63,39.12 207.14,38.61 207.65,38.61 208.15,39.12 208.66,39.12 209.3,38.48 v210.44,38.48
  Bottom 0.152: U2.P$13 207.84,16.23 207.44,16.64 v206.88,16.64 | v210.44,38.48 212.05,38.48 R9.1
N$59
  Bottom 0.152: U2.P$15 209.32,25.68 209.68,26.04 R10.1
N$60  (via drill 0.35)
  Top 0.152: v210.57,24.64 210.57,26.67 v209.3,27.94
  Bottom 0.152: U2.P$16 209.82,23.89 v210.57,24.64 | v209.3,27.94 R11.1
N$61
  Bottom 0.152: U2.P$10 207.51,14.74 207.14,15.11 202.44,15.11 202.05,14.72 Y2.3 202.05,11.22 C5.1
N$62
  Bottom 0.152: U2.P$11 207.65,15.24 207.39,15.49 204.85,15.49 204.35,15.99 Y2.1 204.35,19.26 C6.1
N$64
  Bottom 0.152: U2.P$17 210.32,18.89 R13.1
N$65  (via drill 0.35)
  Top 0.508: J2.VBUS1 221.58,2.63 223.14,4.19 223.14,6.22 221.83,7.53 J2.VBUS2 219.8,7.53 v218.44,8.89
  Bottom 0.508: v218.44,8.89 F1.2
N$66
  Bottom 0.152: U2.P$8 207.29,13.74 206.5,12.95 206.5,10.16 205.49,9.14 R12.2
N$67  (via drill 0.35)
  Top 0.152: J2.B5 218.98,6.83 v218.95,6.86
  Bottom 0.152: v218.95,6.86 216.41,6.86 215.73,7.53 R15.2
ROW1
  Top 0.152: SW1.1 SW2.1 SW3.1 SW4.1 SW5.1 SW6.1 SW7.1 SW8.1 SW9.1 SW10.1 SW11.1 SW12.1
  Bottom 0.152: U1.29 117.34,28.85 122,33.51 122,45.01 121.92,45.09 121.92,59.69 SW8.1
ROW2
  Top 0.152: SW13.1 SW14.1 SW15.1 SW16.1 SW17.1 SW18.1 SW19.1 SW20.1 SW21.1 SW22.1 SW23.1 SW24.1
  Bottom 0.152: U1.28 116.84,28.78 117.14,29.08 117.14,34.59 120.65,38.1 SW20.1
ROW3
  Top 0.152: SW37.1 SW38.1 SW39.1 SW40.1 SW41.1 SW43.1 SW45.1 129.54,11.43 SW46.1 SW47.1 SW48.1
ROW4
  Top 0.152: SW25.1 SW26.1 SW27.1 SW28.1 SW29.1 SW30.1 SW31.1 SW32.1 SW33.1 SW34.1 SW35.1 SW36.1
VCC  (via drill 0.35)
  Top 0.152: v215.26,20.95 v215.26,14.86 | v123.19,15.24 127.13,19.18 179.07,19.18 180.21,20.32 184.28,20.32 185.42,19.18 195.71,19.18 199.39,22.86 199.39,60.96 201.93,63.5 214.63,63.5 216.86,61.27 G1.1
  Bottom 0.152: R1.2 111.42,9.31 112.06,9.95 U1.14 114.38,9.95 115.06,9.27 116.33,9.27 116.34,9.26 | 116.34,9.26 U1.7 | U1.24 114.88,13.97 | 114.88,13.97 114.88,13.52 116.34,12.06 116.34,9.78 | 116.34,9.78 116.34,9.26 | U1.2 118.8,9.02 | 118.8,9.02 118.8,9.22 118.24,9.78 116.34,9.78 | U1.44 118.84,8.97 118.8,9.02 | 114.88,13.97 114.97,13.89 U1.34 121.84,13.89 v123.19,15.24 | U2.P$27 214.65,14.24 v215.26,14.86 216.02,14.1 F1.1 | R13.2 v215.26,20.95
  Bottom 0.508: F1.1 216.86,15.68 G3.1 G2.1 G1.1